# Altium schematic sheet Sheet.SchDoc
size A4
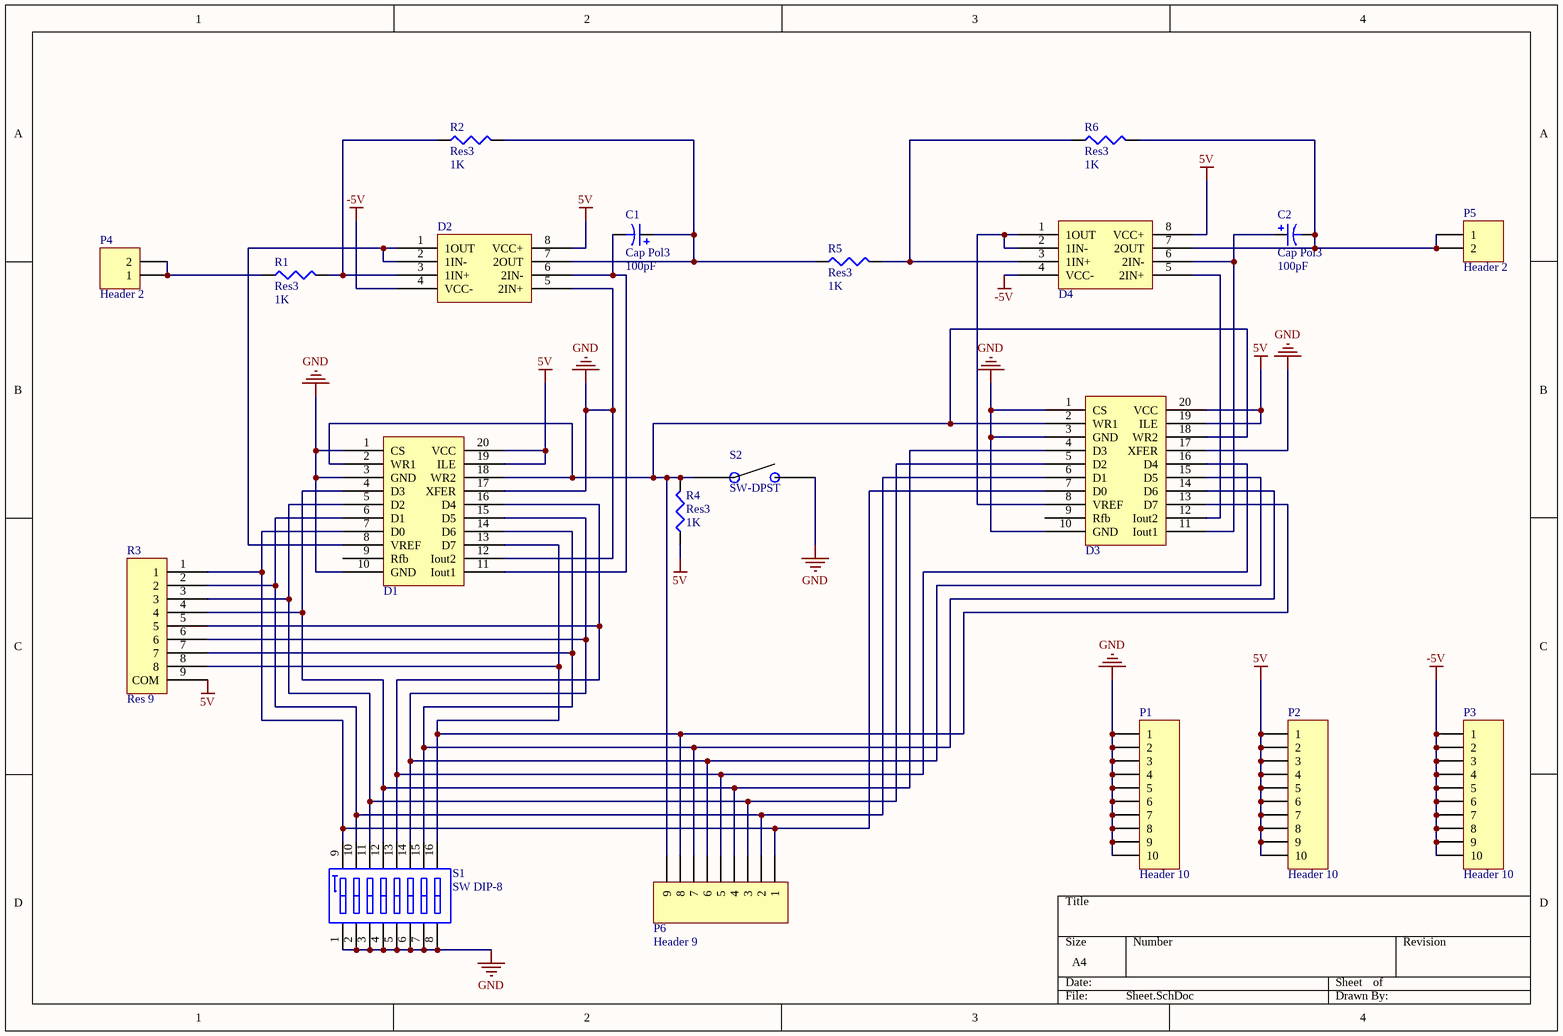
[diagram p0: Sheet.SchDoc]

## Parts
C1  Cap Pol3  value 100pF  [1812]
C2  Cap Pol3  value 100pF  [1812]
D1  DAC  [DIP-20N]  (value not drawn)
D2  D  [DIP-8N]  (value not drawn)
D3  DAC  [DIP-20N]  (value not drawn)
D4  D  [DIP-8N]  (value not drawn)
P1  Header 10  [HDR1X10]
P2  Header 10  [HDR1X10]
P3  Header 10  [HDR1X10]
P4  Header 2  [HDR1X2]
P5  Header 2  [HDR1X2]
P6  Header 9  [HDR1X9]
R1  Res3  value 1K  [J1-0603]
R2  Res3  value 1K  [J1-0603]
R3  Res 9  [HDR1X9]
R4  Res3  value 1K  [J1-0603]
R5  Res3  value 1K  [J1-0603]
R6  Res3  value 1K  [J1-0603]
S1  SW DIP-8  [DIP-16]
S2  SW-DPST  [AN66]

## Nets
5V: D1.19(ILE) D1.20(VCC) D2.8(VCC+) D3.19(ILE) D3.20(VCC) D4.8(VCC+) P2.1 P2.2 P2.3 P2.4 P2.5 P2.6 P2.7 P2.8 P2.9 P2.10 R3.9(COM) R4.1
-5V: D2.4(VCC-) D4.4(VCC-) P3.1 P3.2 P3.3 P3.4 P3.5 P3.6 P3.7 P3.8 P3.9 P3.10
GND: D1.1(CS) D1.3(GND) D1.10(GND) D1.12(Iout2) D1.17(XFER) D2.5(2IN+) D3.1(CS) D3.3(GND) D3.10(GND) D3.17(XFER) P1.1 P1.2 P1.3 P1.4 P1.5 P1.6 P1.7 P1.8 P1.9 P1.10 S1.1(A1) S1.2(A2) S1.3(A3) S1.4(A4) S1.5(A5) S1.6(A6) S1.7(A7) S1.8(A8) S2.1
NetC1_1: C1.1 D2.7(2OUT) R2.2 R5.1
NetC1_2: C1.2 D1.11(Iout1) D2.6(2IN-)
NetC2_1: C2.1 D3.11(Iout1) D4.6(2IN-)
NetC2_2: C2.2 D4.7(2OUT) P5.1 P5.2 R6.2
NetD1_2: D1.2(WR1) D1.18(WR2) D3.2(WR1) D3.18(WR2) P6.9 R4.2 S2.2
NetD1_4: D1.4(D3) D3.4(D3) P6.4 R3.4 S1.12(B5)
NetD1_5: D1.5(D2) D3.5(D2) P6.3 R3.3 S1.11(B6)
NetD1_6: D1.6(D1) D3.6(D1) P6.2 R3.2 S1.10(B7)
NetD1_7: D1.7(D0) D3.7(D0) P6.1 R3.1 S1.9(B8)
NetD1_8: D1.8(VREF) D2.1(1OUT) D2.2(1IN-)
NetD1_13: D1.13(D7) D3.13(D7) P6.8 R3.8 S1.16(B1)
NetD1_14: D1.14(D6) D3.14(D6) P6.7 R3.7 S1.15(B2)
NetD1_15: D1.15(D5) D3.15(D5) P6.6 R3.6 S1.14(B3)
NetD1_16: D1.16(D4) D3.16(D4) P6.5 R3.5 S1.13(B4)
NetD2_3: D2.3(1IN+) R1.2 R2.1
NetD3_8: D3.8(VREF) D4.1(1OUT) D4.2(1IN-)
NetD3_12: D3.12(Iout2) D4.5(2IN+)
NetD4_3: D4.3(1IN+) R5.2 R6.1
NetP4_1: P4.1 P4.2 R1.1

Not connected (* = marked no-connect by the designer): D1 9(Rfb); D3 9(Rfb)

## Library data of the parts
C1 C2 = Cap Pol3: Polarized Capacitor (Surface Mount); Published: 8-Jun-2000; LatestRevisionDate: 29-May-2009; LatestRevisionNote: IPC-7351 Footprint Added.; PackageReference: C0805; Publisher: Altium Limited; PackageDescription: Chip Capacitor
D1 D3 = DAC0832
D2 D4 = TL082
P1-P3 = Header 10: Header, 10-Pin; LatestRevisionDate: 17-Jul-2002; LatestRevisionNote: Re-released for DXP Platform.; Publisher: Altium Limited
P4 P5 = Header 2: Header, 2-Pin; LatestRevisionDate: 17-Jul-2002; LatestRevisionNote: Re-released for DXP Platform.; Publisher: Altium Limited
P6 = Header 9: Header, 9-Pin; LatestRevisionDate: 17-Jul-2002; LatestRevisionNote: Re-released for DXP Platform.; Publisher: Altium Limited
R1 R2 R4-R6 = Res3: Resistor; Published: 8-Jun-2000; LatestRevisionDate: 29-May-2009; LatestRevisionNote: IPC-7351 Footprint Added.; PackageReference: J1-0603; Publisher: Altium Limited; PackageDescription: Chip Resistor
S1 = SW DIP-8: DIP Switch, 8 Position, SPST; Published: 24-Mar-1999; LatestRevisionDate: 17-Jul-2002; LatestRevisionNote: Re-released for DXP Platform.; PackageReference: DIP_SW_8WAY_SMD; Publisher: Altium Limited; PackageDescription: DIP Switch; 16 Leads
S2 = 6x6开关